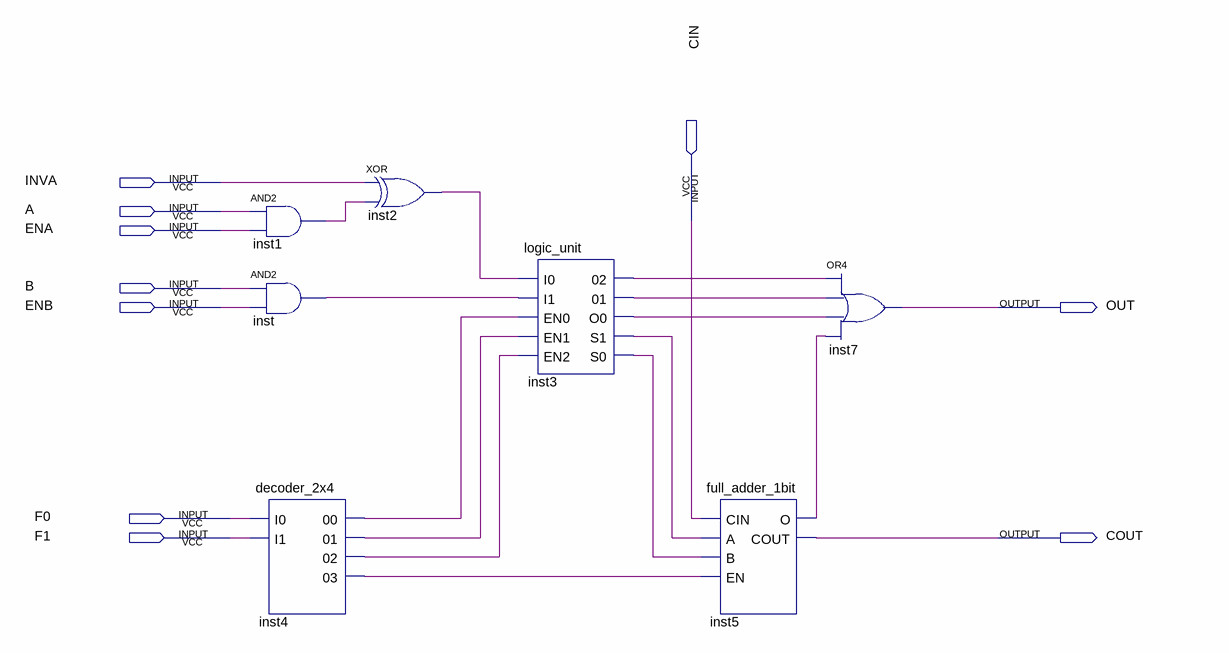
[diagram p0: schematic sheet]
// Quartus schematic ula_1bit.bdf as structural Verilog: 7 symbols, 10 pins
module ula_1bit (
  input  INVA,
  input  A,
  input  CIN,
  input  ENA,
  input  B,
  input  ENB,
  input  F0,
  input  F1,
  output OUT,
  output COUT
);

  wire inst1_out, inst2_out, inst3_01, inst3_02, inst3_o0, inst3_s0, inst3_s1, inst4_00, inst4_01, inst4_02,
       inst4_03, inst5_o, inst_out;

  and inst1 (inst1_out, A, ENA);
  and inst (inst_out, B, ENB);
  decoder_2x4 inst4 (.I0(F0), .I1(F1), .\00 (inst4_00), .\01 (inst4_01), .\02 (inst4_02), .\03 (inst4_03));
  xor inst2 (inst2_out, INVA, inst1_out);
  logic_unit inst3 (
    .I0(inst2_out), .I1(inst_out), .EN0(inst4_00), .EN1(inst4_01), .EN2(inst4_02), .\02 (inst3_02),
    .\01 (inst3_01), .O0(inst3_o0), .S1(inst3_s1), .S0(inst3_s0));
  full_adder_1bit inst5 (.CIN(CIN), .A(inst3_s1), .B(inst3_s0), .EN(inst4_03), .O(inst5_o), .COUT(COUT));
  or inst7 (OUT, inst3_02, inst3_01, inst3_o0, inst5_o);
endmodule
